# EAGLE design Nintendo 2DS USB-C (EAGLE 6.2)
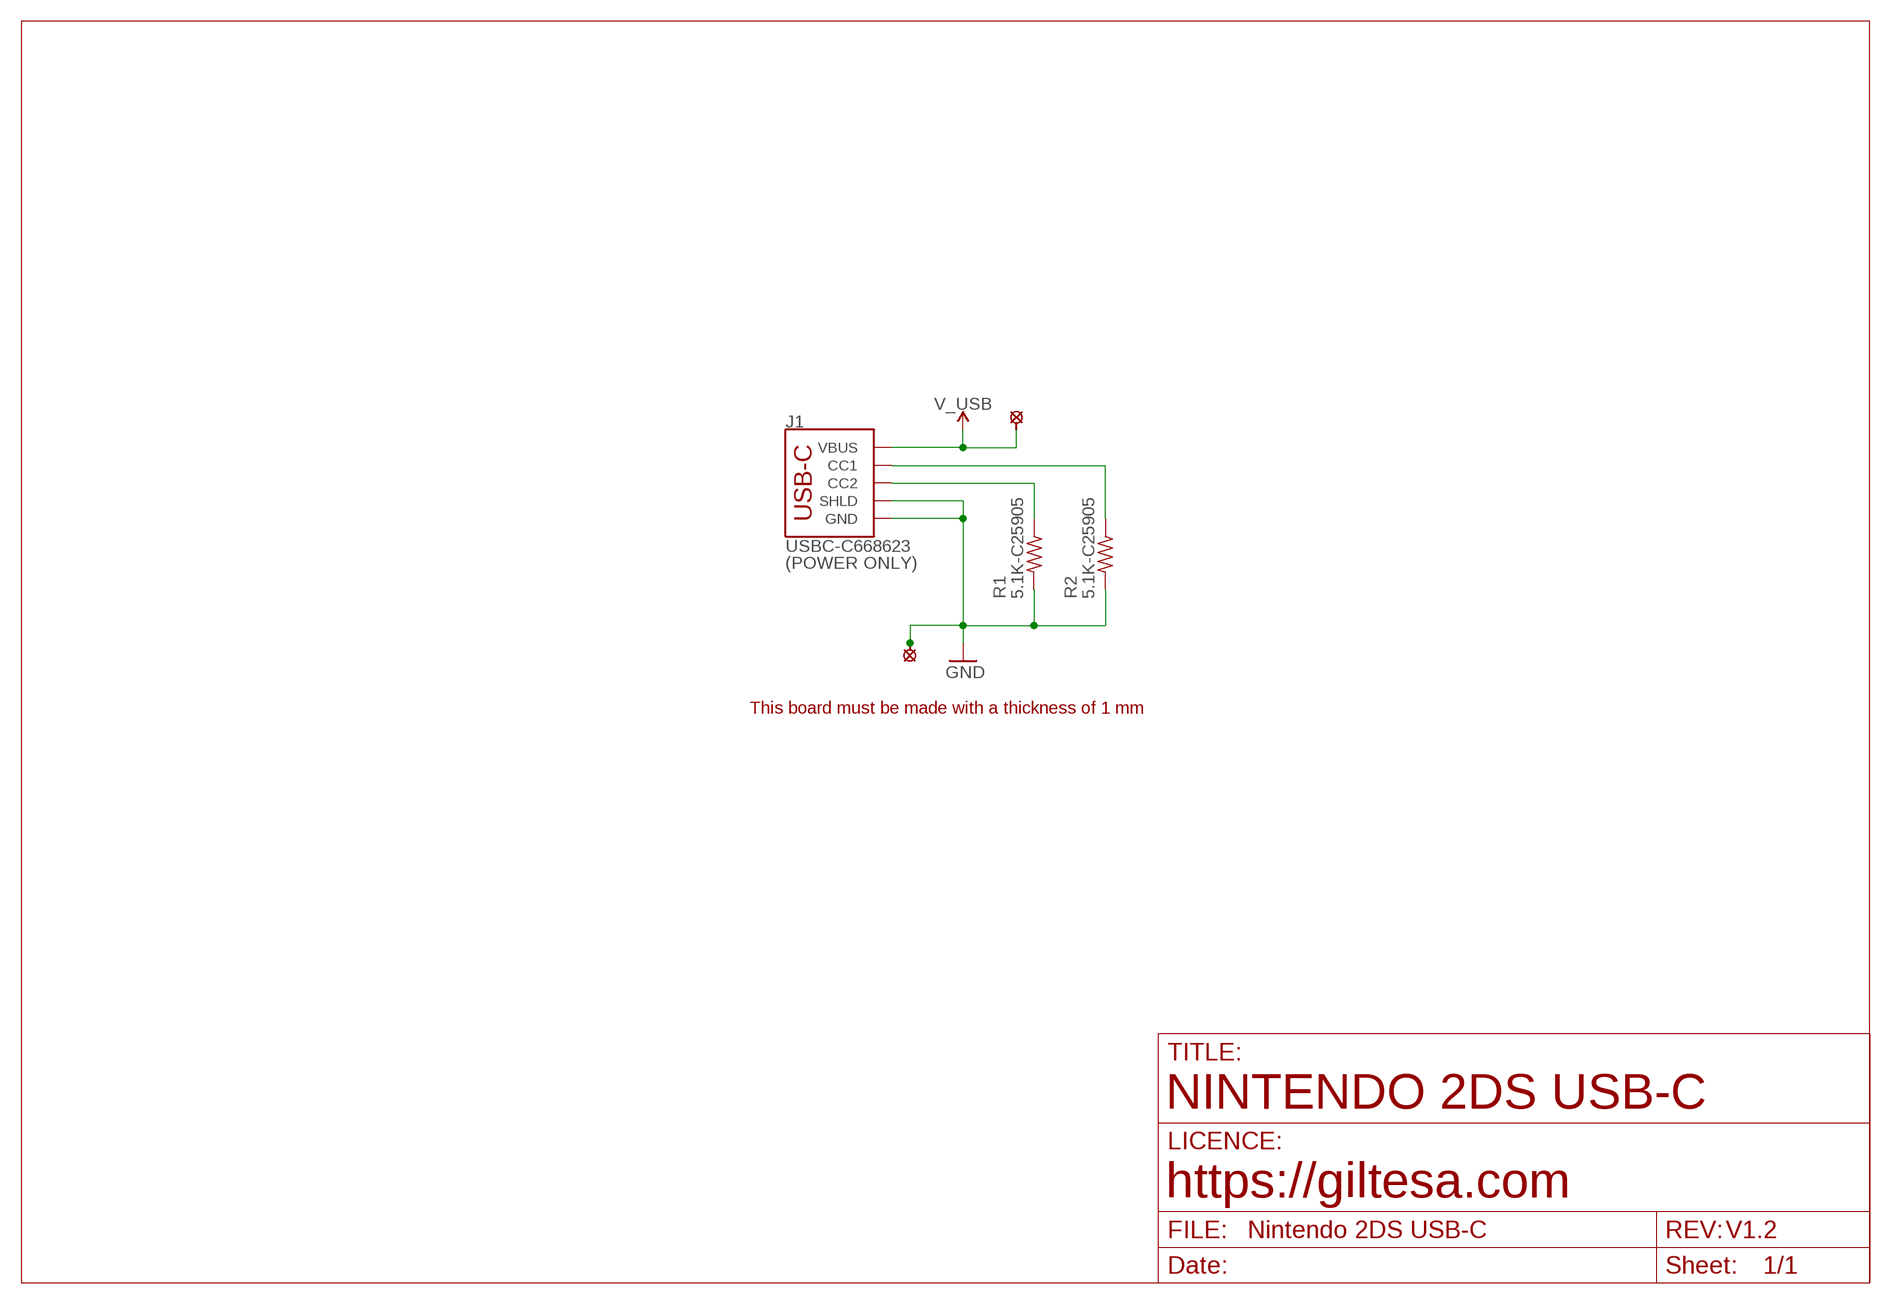
[diagram p0: schematic, sheet 1]

## Parts
J1  USBC-C668623  USB-C_6P_POWER  [USB-C_6P]
R1  5.1K-C25905  R0402  [R0402]
R2  5.1K-C25905  R0402  [R0402]
U$2  PAD_1.0H  [PAD_1.0_HALF_MASK]
U$3  PAD_1.0H  [PAD_1.0_HALF_MASK]
U$4  PAD_1.0H  [PAD_1.0_HALF_MASK]
U$5  PAD_1.0H  [PAD_1.0_HALF_MASK]

## Nets
GND: J1.A12-GND(GND) J1.B12-GND(GND) J1.SHLD1(SHLD) J1.SHLD2(SHLD) J1.SHLD3(SHLD) J1.SHLD4(SHLD) R1.2 R2.2 U$3.P$1 U$4.P$1 U$5.P$1
N$4: J1.B5(CC2) R1.1
N$13: J1.A5(CC1) R2.1
V_USB: J1.A9-VBUS(VBUS) J1.B9-VBUS(VBUS) U$2.P$1

## Notes on the sheet
- (POWER ONLY)
- This board must be made with a thickness of 1 mm
- NINTENDO 2DS USB-C
- https://giltesa.com
- V1.2

## Library data of the parts
J1 = ,giltesa:USB-C_6P
R1 R2 = ,giltesa:R0402
U$2-U$5 = ,giltesa:PAD

## Net classes
1 power: width 0.61 mm, drill 0.406 mm, clearance 0.203 mm
2 gnd: width 0.305 mm, drill 0.406 mm, clearance 0.203 mm
3 power usb: width 0.508 mm, drill 0.406 mm, clearance 0.203 mm

## Board
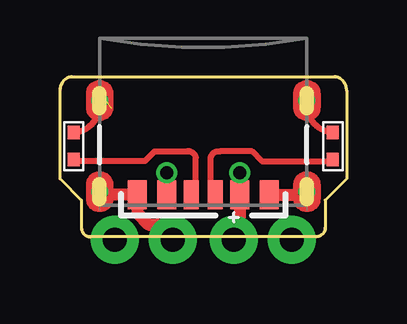
[diagram p1: board, top side]
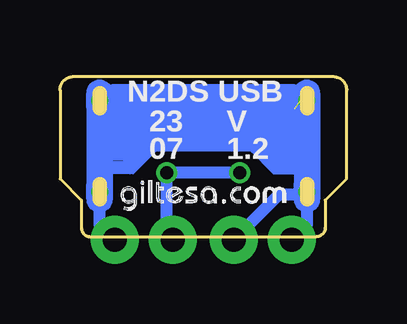
[diagram p2: board, bottom side, seen from below]

Size 11.94 x 6.67 mm. Coordinates in mm from the lower left corner, seen from the top.
Outline: 11.94,6.1 11.94,2.41 11.05,1.52 11.05,0.38 arc-90 10.67,0 1.27,0 arc-90 0.89,0.38 0.89,1.52 0,2.41 0,6.1 arc-90 0.51,6.67 11.43,6.67 arc-90 11.94,6.1
Copper layers (1*16): Top 0.035mm / dielectric 1.6mm / Bottom 0.035mm
Design rules: minimum track width 6mil, minimum drill 12mil, track to track 6mil, track to pad 6mil, pad to pad 6mil, via to via 8mil, smd to smd 0mil, copper to edge 20mil, drill to drill 10mil, minimum pad ring 6mil, minimum via ring 6mil, stop-mask expansion 0mil, vias tented up to drill 100mil, thermal gap 10mil

### Footprints (pad centres in the part's own frame; a part is rotated, then mirrored left to right if it is on the bottom)
USB-C_6P = smd 0.635 x 1.2: A5 -0.5,2.034; B5 0.5,2.034 | smd 0.8 x 1.2: A9-VBUS 1.52,2.034; A12-GND 2.75,2.034; B9-VBUS -1.52,2.034; B12-GND -2.75,2.034 | drill 0.4 pad 0.6: SHLD1 -4.318,1.9; SHLD2 4.32,1.9; SHLD3 -4.318,-1.9; SHLD4 4.32,-1.9
R0402 = smd 0.559 x 0.5: 1 -0.567,0; 2 0.567,0
PAD_1.0_HALF_MASK = drill 1 pad 2: P$1 0,0

### Placement (x,y rotation side)
J1  5.97,3.78 180 top
R1  0.57,3.78 90 top
R2  11.37,3.78 90 top
U$1  [N2DS]  5.97,0 0 top
U$2  7.24,-0.13 0 top
U$3  2.29,-0.13 0 top
U$4  4.7,-0.13 0 top
U$5  9.65,-0.13 0 top
U$11  [GILTESA.COM_MASK_7MM]  9.45,1.02 0 bottom

### Tracks (layer width: path | path; a pad name or v marks a point on that pad's centre or on a via)
GND  (6 unrouted)
  Top 0.254: R1.2 arc90 1.65,5.55 J1.SHLD4 | R2.2 arc-90 10.29,5.55
  Top 0.508: J1.SHLD2 1.78,1.75 J1.A12-GND 3.22,0.97 3.68,0.51 4.06,0.51 U$4.P$1 | J1.B12-GND 10.29,1.75 J1.SHLD1 | 10.29,5.55 J1.SHLD3
  Bottom 0.127: 10.03,3.56 10.08,3.61 10.08,4.17 9.74,4.51 9.74,4.71
  Bottom 0.254: 1.78,2.79 2.79,2.79 3.56,3.56 2.03,3.56 1.91,3.68 1.91,2.92 2.67,2.92 3.18,3.43 2.03,3.43 2.03,3.05 2.67,3.05 2.67,3.17 2.79,3.3 2.16,3.3 | 10.03,2.79 9.02,2.79 8.26,3.56 10.03,3.56 10.03,2.92 9.14,2.92 8.64,3.43 9.91,3.43 9.91,3.05 9.27,3.05 9.02,3.3 9.78,3.3
  Bottom 0.508: J1.SHLD2 J1.SHLD4 1.65,4.96 2.41,4.57 | J1.SHLD2 1.65,0.51 U$3.P$1 | U$5.P$1 10.29,0.51 J1.SHLD1 10.03,2.79 | 9.53,4.57 9.74,4.71 10.29,5.08 J1.SHLD3 | J1.SHLD2 1.75,1.78 2.79,1.78 U$4.P$1 | 1.78,2.79 1.65,2.79 J1.SHLD2 | J1.SHLD3 J1.SHLD1
  Bottom 0.584: 1.4,5.68 1.4,1.88 | 10.54,5.68 10.54,1.88 | 1.9,5.68 1.9,1.88 | 10.04,5.68 10.04,1.88
  Bottom 2.032: 2.41,4.57 9.53,4.57 | 2.16,5.33 9.78,5.33
N$3
  Bottom 0.127: 2.92,2.67 3.05,2.67 3.94,3.56 | 2.92,2.67 2.79,2.67 | 2.79,2.67 1.91,2.67 | 2.92,2.67 3.81,3.56 | 2.79,2.67 3.68,3.56
N$4
  Top 0.254: J1.B5 5.47,1.91 5.66,2.03 5.66,3.3 arc90 5.28,3.56 3.94,3.56 3.53,3.15 0.51,3.15 R1.1
N$5
  Bottom 0.127: 9.91,2.67 9.02,2.67 8.13,3.56 | 9.91,2.67 10.03,2.67 | 8,3.56 8.89,2.67 9.91,2.67
N$13
  Top 0.254: J1.A5 6.47,1.79 6.28,1.91 6.28,3.3 arc-90 6.66,3.56 8,3.56 8.41,3.15 11.43,3.15 R2.1
V_USB  (via drill 0.56)
  Top 0.508: v7.49,2.67 J1.B9-VBUS 7.49,0.12 U$2.P$1 | J1.A9-VBUS v4.45,2.67
  Bottom 0.508: U$2.P$1 7.49,0.13 v7.49,2.67 v4.45,2.67

### Text on the board
bPlace: N2DS USB | V | 23 | 1.2 | 07